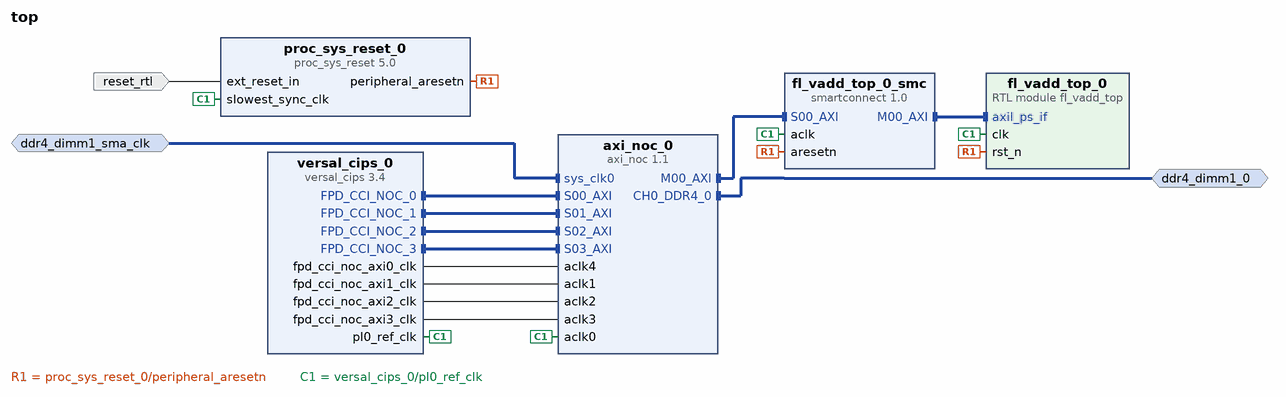
[diagram p0: block diagram of the top level]
# Vivado block design top, xcvc1902-vsva2197-2MP-e-S, Vivado 2024.2.1
create_bd_design top

create_bd_intf_port -mode Master -vlnv xilinx.com:interface:ddr4_rtl:1.0 ddr4_dimm1_0
create_bd_intf_port -mode Slave -vlnv xilinx.com:interface:diff_clock_rtl:1.0 ddr4_dimm1_sma_clk
set_property -dict {CONFIG.FREQ_HZ 200000000} [get_bd_intf_ports ddr4_dimm1_sma_clk]
create_bd_port -dir I -type rst reset_rtl
set_property -dict {CONFIG.POLARITY ACTIVE_LOW} [get_bd_ports reset_rtl]

create_bd_cell -type ip -vlnv xilinx.com:ip:versal_cips:3.4 versal_cips_0
set_property -dict [list \
  CONFIG.BOOT_MODE Custom \
  CONFIG.CLOCK_MODE Custom \
  CONFIG.DDR_MEMORY_MODE Custom \
  CONFIG.IO_CONFIG_MODE Custom \
  CONFIG.PS_PMC_CONFIG {['BOOT_MODE Custom', 'CLOCK_MODE Custom', 'DDR_MEMORY_MODE Custom', 'DESIGN_MODE 1', 'IO_CONFIG_MODE Custom', 'PMC_CRP_PL0_REF_CTRL_FREQMHZ 350', 'PMC_HSM1_CLK_OUT_ENABLE 0', 'PMC_OSPI_PERIPHERAL {{ENABLE 1} {IO {PMC_MIO 0 .. 11}} {MODE Single}}', 'PMC_SD0_PERIPHERAL {{CLK_100_SDR_OTAP_DLY 0x00} {CLK_200_SDR_OTAP_DLY 0x00} {CLK_50_DDR_ITAP_DLY 0x00} {CLK_50_DDR_OTAP_DLY 0x00} {CLK_50_SDR_ITAP_DLY 0x00} {CLK_50_SDR_OTAP_DLY 0x00} {ENABLE 0} {IO {PMC_MIO 13 .. 25}}}', 'PMC_SD1_PERIPHERAL {{CLK_100_SDR_OTAP_DLY 0x00} {CLK_200_SDR_OTAP_DLY 0x00} {CLK_50_DDR_ITAP_DLY 0x00} {CLK_50_DDR_OTAP_DLY 0x00} {CLK_50_SDR_ITAP_DLY 0x2C} {CLK_50_SDR_OTAP_DLY 0x4} {ENABLE 1} {IO {PMC_MIO 26 .. 36}}}', 'PMC_USE_PMC_NOC_AXI0 0', 'PS_BOARD_INTERFACE Custom', 'PS_UART0_PERIPHERAL {{ENABLE 1} {IO {PS_MIO 0 .. 1}}}', 'PS_UART1_PERIPHERAL {{ENABLE 0} {IO {PMC_MIO 4 .. 5}}}', 'PS_USE_FPD_CCI_NOC 1', 'PS_USE_PMCPL_CLK0 1', 'SMON_ALARMS Set_Alarms_On', 'SMON_ENABLE_TEMP_AVERAGING 0', 'SMON_TEMP_AVERAGING_SAMPLES 0']} \
] [get_bd_cells versal_cips_0]
create_bd_cell -type ip -vlnv xilinx.com:ip:axi_noc:1.1 axi_noc_0
set_property -dict [list \
  CONFIG.CH0_DDR4_0_BOARD_INTERFACE ddr4_dimm1 \
  CONFIG.MC_CHAN_REGION1 NONE \
  CONFIG.NUM_CLKS 5 \
  CONFIG.NUM_MC 1 \
  CONFIG.NUM_MI 1 \
  CONFIG.NUM_NSI 0 \
  CONFIG.NUM_SI 4 \
  CONFIG.sys_clk0_BOARD_INTERFACE ddr4_dimm1_sma_clk \
] [get_bd_cells axi_noc_0]
create_bd_cell -type ip -vlnv xilinx.com:ip:proc_sys_reset:5.0 proc_sys_reset_0
create_bd_cell -type module -reference fl_vadd_top fl_vadd_top_0
set_property -dict {CONFIG.AXI_PS_ADDR_WIDTH 2 CONFIG.AXI_PS_DEPTH 4} [get_bd_cells fl_vadd_top_0]
create_bd_cell -type ip -vlnv xilinx.com:ip:smartconnect:1.0 fl_vadd_top_0_smc
set_property -dict {CONFIG.NUM_MI 1 CONFIG.NUM_SI 1} [get_bd_cells fl_vadd_top_0_smc]

# ---- connections ----

connect_bd_intf_net [get_bd_intf_ports ddr4_dimm1_0] [get_bd_intf_pins axi_noc_0/CH0_DDR4_0]
connect_bd_intf_net [get_bd_intf_pins fl_vadd_top_0_smc/S00_AXI] [get_bd_intf_pins axi_noc_0/M00_AXI]
connect_bd_intf_net [get_bd_intf_ports ddr4_dimm1_sma_clk] [get_bd_intf_pins axi_noc_0/sys_clk0]
connect_bd_intf_net [get_bd_intf_pins fl_vadd_top_0/axil_ps_if] [get_bd_intf_pins fl_vadd_top_0_smc/M00_AXI]
connect_bd_intf_net [get_bd_intf_pins versal_cips_0/FPD_CCI_NOC_0] [get_bd_intf_pins axi_noc_0/S00_AXI]
connect_bd_intf_net [get_bd_intf_pins versal_cips_0/FPD_CCI_NOC_1] [get_bd_intf_pins axi_noc_0/S01_AXI]
connect_bd_intf_net [get_bd_intf_pins versal_cips_0/FPD_CCI_NOC_2] [get_bd_intf_pins axi_noc_0/S02_AXI]
connect_bd_intf_net [get_bd_intf_pins versal_cips_0/FPD_CCI_NOC_3] [get_bd_intf_pins axi_noc_0/S03_AXI]
connect_bd_net [get_bd_pins proc_sys_reset_0/peripheral_aresetn] [get_bd_pins fl_vadd_top_0_smc/aresetn] [get_bd_pins fl_vadd_top_0/rst_n]
connect_bd_net [get_bd_ports reset_rtl] [get_bd_pins proc_sys_reset_0/ext_reset_in]
connect_bd_net [get_bd_pins versal_cips_0/fpd_cci_noc_axi0_clk] [get_bd_pins axi_noc_0/aclk4]
connect_bd_net [get_bd_pins versal_cips_0/fpd_cci_noc_axi1_clk] [get_bd_pins axi_noc_0/aclk1]
connect_bd_net [get_bd_pins versal_cips_0/fpd_cci_noc_axi2_clk] [get_bd_pins axi_noc_0/aclk2]
connect_bd_net [get_bd_pins versal_cips_0/fpd_cci_noc_axi3_clk] [get_bd_pins axi_noc_0/aclk3]
connect_bd_net [get_bd_pins versal_cips_0/pl0_ref_clk] \
  [get_bd_pins fl_vadd_top_0/clk] [get_bd_pins fl_vadd_top_0_smc/aclk] [get_bd_pins proc_sys_reset_0/slowest_sync_clk] \
  [get_bd_pins axi_noc_0/aclk0]
set_property PFM.CLOCK {pl0_ref_clk {id "0" is_default "true" proc_sys_reset "/proc_sys_reset_0" status "fixed" freq_hz "333329987"}} [get_bd_cells versal_cips_0]

# ---- address map ----
assign_bd_address -offset 0x0000020100000000 -range 4K -target_address_space [get_bd_addr_spaces versal_cips_0/FPD_CCI_NOC_0] [get_bd_addr_segs fl_vadd_top_0/axil_ps_if/reg0]

validate_bd_design
save_bd_design
